# Altium schematic sheet SIQ-02FVS3_1_2022-03-15.schdoc
size 151 x 118 mm
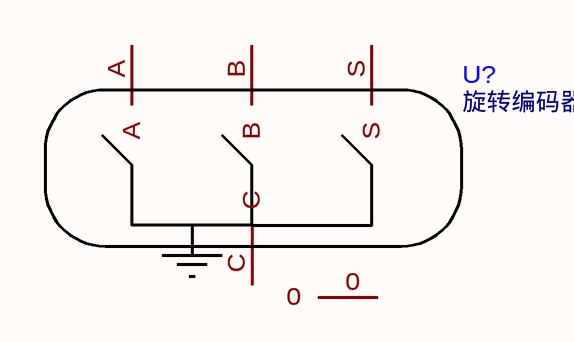
[diagram p0: SIQ-02FVS3_1_2022-03-15.schdoc]

## Parts
U?  旋转编码器  [SW-SMD_SIQ-02FVS3_1]

## Nets

Not connected (* = marked no-connect by the designer): U? 0 A B C S

## Library data of the parts
U? = SIQ-02FVS3_1